# Altium schematic sheet ClosedLoop_Drive_CAN_Transceivers.SchDoc
size A4; SheetNumber: 7; SheetTotal: 8
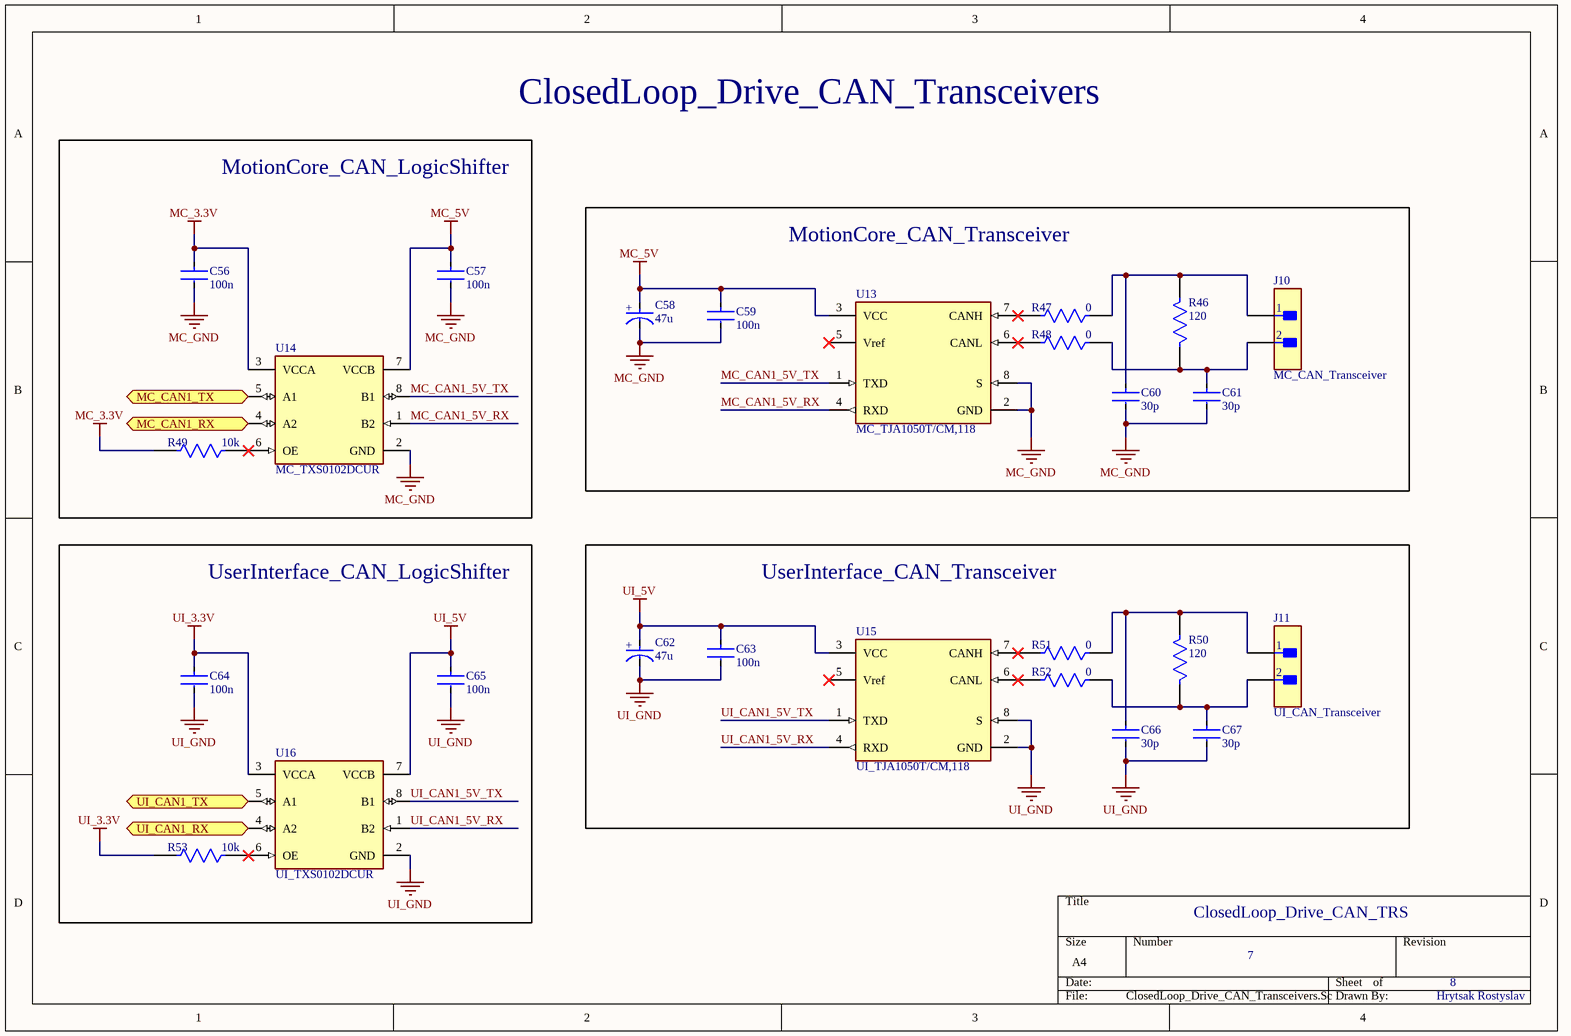
[diagram p0: ClosedLoop_Drive_CAN_Transceivers.SchDoc]

## Parts
C56  100n  [FP-0805-L_2_01_0_2-W_1_25-MFG]
C57  100n  [FP-0805-L_2_01_0_2-W_1_25-MFG]
C58  47u  [FP-RAD-TH-D_6_3_0_5-L_11-MFG]
C59  100n  [FP-0805-L_2_01_0_2-W_1_25-MFG]
C60  30p  [FP-0805-L_2_01_0_2-W_1_25-MFG]
C61  30p  [FP-0805-L_2_01_0_2-W_1_25-MFG]
C62  47u  [FP-RAD-TH-D_6_3_0_5-L_11-MFG]
C63  100n  [FP-0805-L_2_01_0_2-W_1_25-MFG]
C64  100n  [FP-0805-L_2_01_0_2-W_1_25-MFG]
C65  100n  [FP-0805-L_2_01_0_2-W_1_25-MFG]
C66  30p  [FP-0805-L_2_01_0_2-W_1_25-MFG]
C67  30p  [FP-0805-L_2_01_0_2-W_1_25-MFG]
J10  MC_CAN_Transceiver  [FP-TSW-102-07-F-S-MFG]
J11  UI_CAN_Transceiver  [FP-TSW-102-07-F-S-MFG]
R46  120  [FP-MCU0805-IPC_A]
R47  0  [FP-MCU0805-IPC_A]
R48  0  [FP-MCU0805-IPC_A]
R49  10k  [FP-MCU0805-IPC_A]
R50  120  [FP-MCU0805-IPC_A]
R51  0  [FP-MCU0805-IPC_A]
R52  0  [FP-MCU0805-IPC_A]
R53  10k  [FP-MCU0805-IPC_A]
U13  MC_TJA1050T/CM,118  [FP-SOT96-1-IPC_A]
U14  MC_TXS0102DCUR  [FP-DCU0008A-MFG]
U15  UI_TJA1050T/CM,118  [FP-SOT96-1-IPC_A]
U16  UI_TXS0102DCUR  [FP-DCU0008A-MFG]

## Blocks framed on the sheet
MotionCore_CAN_LogicShifter: C56 C57 R49 U14
MotionCore_CAN_Transceiver: C58-C61 J10 R46-R48 U13
UserInterface_CAN_LogicShifter: C64 C65 R53 U16
UserInterface_CAN_Transceiver: C62 C63 C66 C67 J11 R50-R52 U15

## Ports
MC_CAN1_RX (bidir, see ClosedLoop_Drive_MotionCore[1D]), MC_CAN1_TX (bidir, see ClosedLoop_Drive_MotionCore[1D]), UI_CAN1_RX (bidir, see ClosedLoop_Drive_UserInterface[3C]), UI_CAN1_TX (bidir, see ClosedLoop_Drive_UserInterface[3C])

## Nets
MC_3.3V: C56.1 R49.2 U14.3(VCCA)
MC_5V: C57.1 C58.2(A) C59.1 U13.3(VCC) U14.7(VCCB)
MC_GND: C56.2 C57.2 C58.1(C) C59.2 C60.2 C61.2 U13.2(GND) U13.8(S) U14.2(GND)
UI_3.3V: C64.1 R53.2 U16.3(VCCA)
UI_5V: C62.2(A) C63.1 C65.1 U15.3(VCC) U16.7(VCCB)
UI_GND: C62.1(C) C63.2 C64.2 C65.2 C66.2 C67.2 U15.2(GND) U15.8(S) U16.2(GND)
MC_CAN1_5V_RX: U13.4(RXD) U14.1(B2)
MC_CAN1_5V_TX: U13.1(TXD) U14.8(B1)
MC_CAN1_RX: U14.4(A2) ; port MC_CAN1_RX
MC_CAN1_TX: U14.5(A1) ; port MC_CAN1_TX
UI_CAN1_5V_RX: U15.4(RXD) U16.1(B2)
UI_CAN1_5V_TX: U15.1(TXD) U16.8(B1)
UI_CAN1_RX: U16.4(A2) ; port UI_CAN1_RX
UI_CAN1_TX: U16.5(A1) ; port UI_CAN1_TX
NetC60_1: C60.1 J10.1 R46.2 R47.1
NetC61_1: C61.1 J10.2 R46.1 R48.1
NetC66_1: C66.1 J11.1 R50.2 R51.1
NetC67_1: C67.1 J11.2 R50.1 R52.1
NetR47_2: R47.2 U13.7(CANH)
NetR48_2: R48.2 U13.6(CANL)
NetR49_1: R49.1 U14.6(OE)
NetR51_2: R51.2 U15.7(CANH)
NetR52_2: R52.2 U15.6(CANL)
NetR53_1: R53.1 U16.6(OE)

Not connected (* = marked no-connect by the designer): U13 5(Vref)*; U15 5(Vref)*

## Notes on the sheet
- ClosedLoop_Drive_CAN_Transceivers
- ClosedLoop_Drive_CAN_TRS
- 7
- 8
- Hrytsak Rostyslav
- (in symbol CMP-05427-000141-1) +

## Library data of the parts
C56 C57 C59-C61 C63-C67 = CMP-07738-122049624-1: 0805; Tolerance: 10%; Dielectric: X7R; Material: Ceramic; Voltage Rating (DC): 100V; Capacitance: 1µF; Case/Package: 0805; Height: 1.4mm; Voltage Rating: 100V; Schedule B: 8532240020; NexarPartId: 122049624; RoHS: Compliant; Lifecycle Status: Production; Min Operating Temperature: -55°C; Max Operating Temperature: 125°C
C58 C62 = CMP-05427-000141-1: Aluminum Electrolytic Capacitors (Radial Lead Type) AEC-Q200 Qualified 100uF ±20% 25V; Lead Diameter: 0.5mm; Life (Hours): 1000Hour; Ripple Current: 130mA; Lead/Base Style: Straight; Construction: RADIAL; Radiation Hardening: No; Packaging: Ammo Pack; Termination: Radial; Mount: Through Hole; Lead Pitch: 2.5mm; Tolerance: 20%; Height - Seated (Max): 0.48inch; Height: 11.2mm; Max Operating Temperature: 105°C; Length: 11.2mm; Diameter: 6.3mm; RoHS Compliant: Yes; Voltage Rating: 25V; Min Operating Temperature: -55°C; Package Quantity: 2000; Capacitance: 100uF; Width: 6.3mm; Voltage Rating (DC): 25V; Series: NHG; Contact Plating: Tin; Case/Package: Radial
J10 J11 = CMP-02766-001458-1: CONN HEADER VERT 2POS 2.54MM; Gender: Male; Max Current Rating: 7.6A; Number of Contacts: 2; Max Voltage Rating (AC): 550V; Orientation: Straight; Depth: 2.54mm; Series: TSW; Package Quantity: 1; Min Operating Temperature: -55°C; Max Operating Temperature: 125°C; Contact Type: Male Pin; Contact Shape: Square; Color: Black; Housing Color: Black; Connector Type: Header; Fastening Type: Pull; Radiation Hardening: No; Pitch: 2.54mm; Housing Material: Polyester; Mount: Through Hole; Number of Positions: 2; Number of Rows: 1; Contact Material: Bronze; Insulation Color: Black; Contact Finish - Mating: GOLD; Termination: Solder; Insulation Material: PBT; Length: 5.08mm; Flammability Rating: UL94 V-0; Contact Mating Length: 0.23inch; REACH SVHC: No SVHC; Contact Plating: Gold; RoHS Compliant: Yes; Packaging: Bulk
R46-R53 = CMP-02407-001153-1: 0805; Power Rating: 200mW; Temperature Coefficient: 25ppm/°C; Voltage Rating: 150V; Resistance: 4.99kR; Tolerance: 0.5%; Case Code (Imperial): 0805; Features: Automotive AEC-Q200; Case Code (Metric): 2012; Weight: 0.000162oz; Width: 0.049inch; Packaging: Tape and Reel; Composition: Thin Film; Height: 0.024inch; Termination: SMD/SMT; Number of Terminations: 2; Min Operating Temperature: -55°C; Length: 0.079inch; Package Quantity: 5000; Max Operating Temperature: 175°C; Case/Package: 0805; Max Power Dissipation: 200mW
U13 U15 = CMP-2000-04923-2: IC TRANSCEIVER HALF 1/1 8SO; Simplex/Duplex: Half Duplex; Max Supply Current: 10mA; Number of Receive Buffers: 1; Min Supply Voltage: 4.75V; Max Supply Voltage: 5.25V; Interface: CAN; Data Rate: 1Mbps; Receiver Hysteresis: 70mV; Number of Transmit Buffers: 1; Min Operating Temperature: -40°C; Case/Package: SO; REACH SVHC: No SVHC; Max Operating Temperature: 150°C; Number of Pins: 8; Lead Free: Lead Free; Number of Transceivers: 1; Packaging: Tape and Reel; Mount: Surface Mount; Radiation Hardening: No; Nominal Supply Current: 10mA; Package Quantity: 2500; Contact Plating: Gold
U14 U16 = CMP-0859-00001-2: IC TRNSLTR BIDIRECTIONAL US8; Manufacturer: Texas Instruments; Number Of Circuits: 1; Number Of Inputs: 2; Data Rate: 24Mbits/s; Max Junction Temp: +150°C; V A Min: 1.65V; Standoff Height: 0mm; Logic Function Desc: Bidirectional Voltage-Level Translator; Max Supply Voltage: 5.5V; V A Max: 3.6V; Nominal Supply Current: 1-14.4uA; V B Min: 2.3V; Temperature: -40°C to +85°C; Temperature Range Low: -40°C; Height: 0.9mm; Device Class L1: Integrated Circuits (ICs); RoHS: TRUE; Min Supply Voltage: 1.65V; Digikey Description: IC TRNSLTR BIDIRECTIONAL US8; ComponentLink2Description: Datasheet; Octopart: https://octopart.com/txs0102dcur-texas+instruments-5414308; Temperature Range High: +85°C; Device Class L2: Logic ICs; Category: IC; Ambient Temperature Range High: +85°C; Automotive: No; Manufacturer Part Number: TXS0102DCUR; Device Class L3: Voltage Level Shifters; Number Of Outputs: 2; Ambient Temperature Range Low: -40°C; Lead Free: Yes; ComponentLink2URL: http://www.ti.com/lit/ds/symlink/txs0102.pdf; V B Max: 5.5V; Package: DCU0008A; Mouser Description: Translation - Voltage Levels 2-Bit Bi-Directional Voltage-Level-Trans